# EAGLE design v1-cellphone (EAGLE 6.4)

## Sheet 1 of 3: PWR
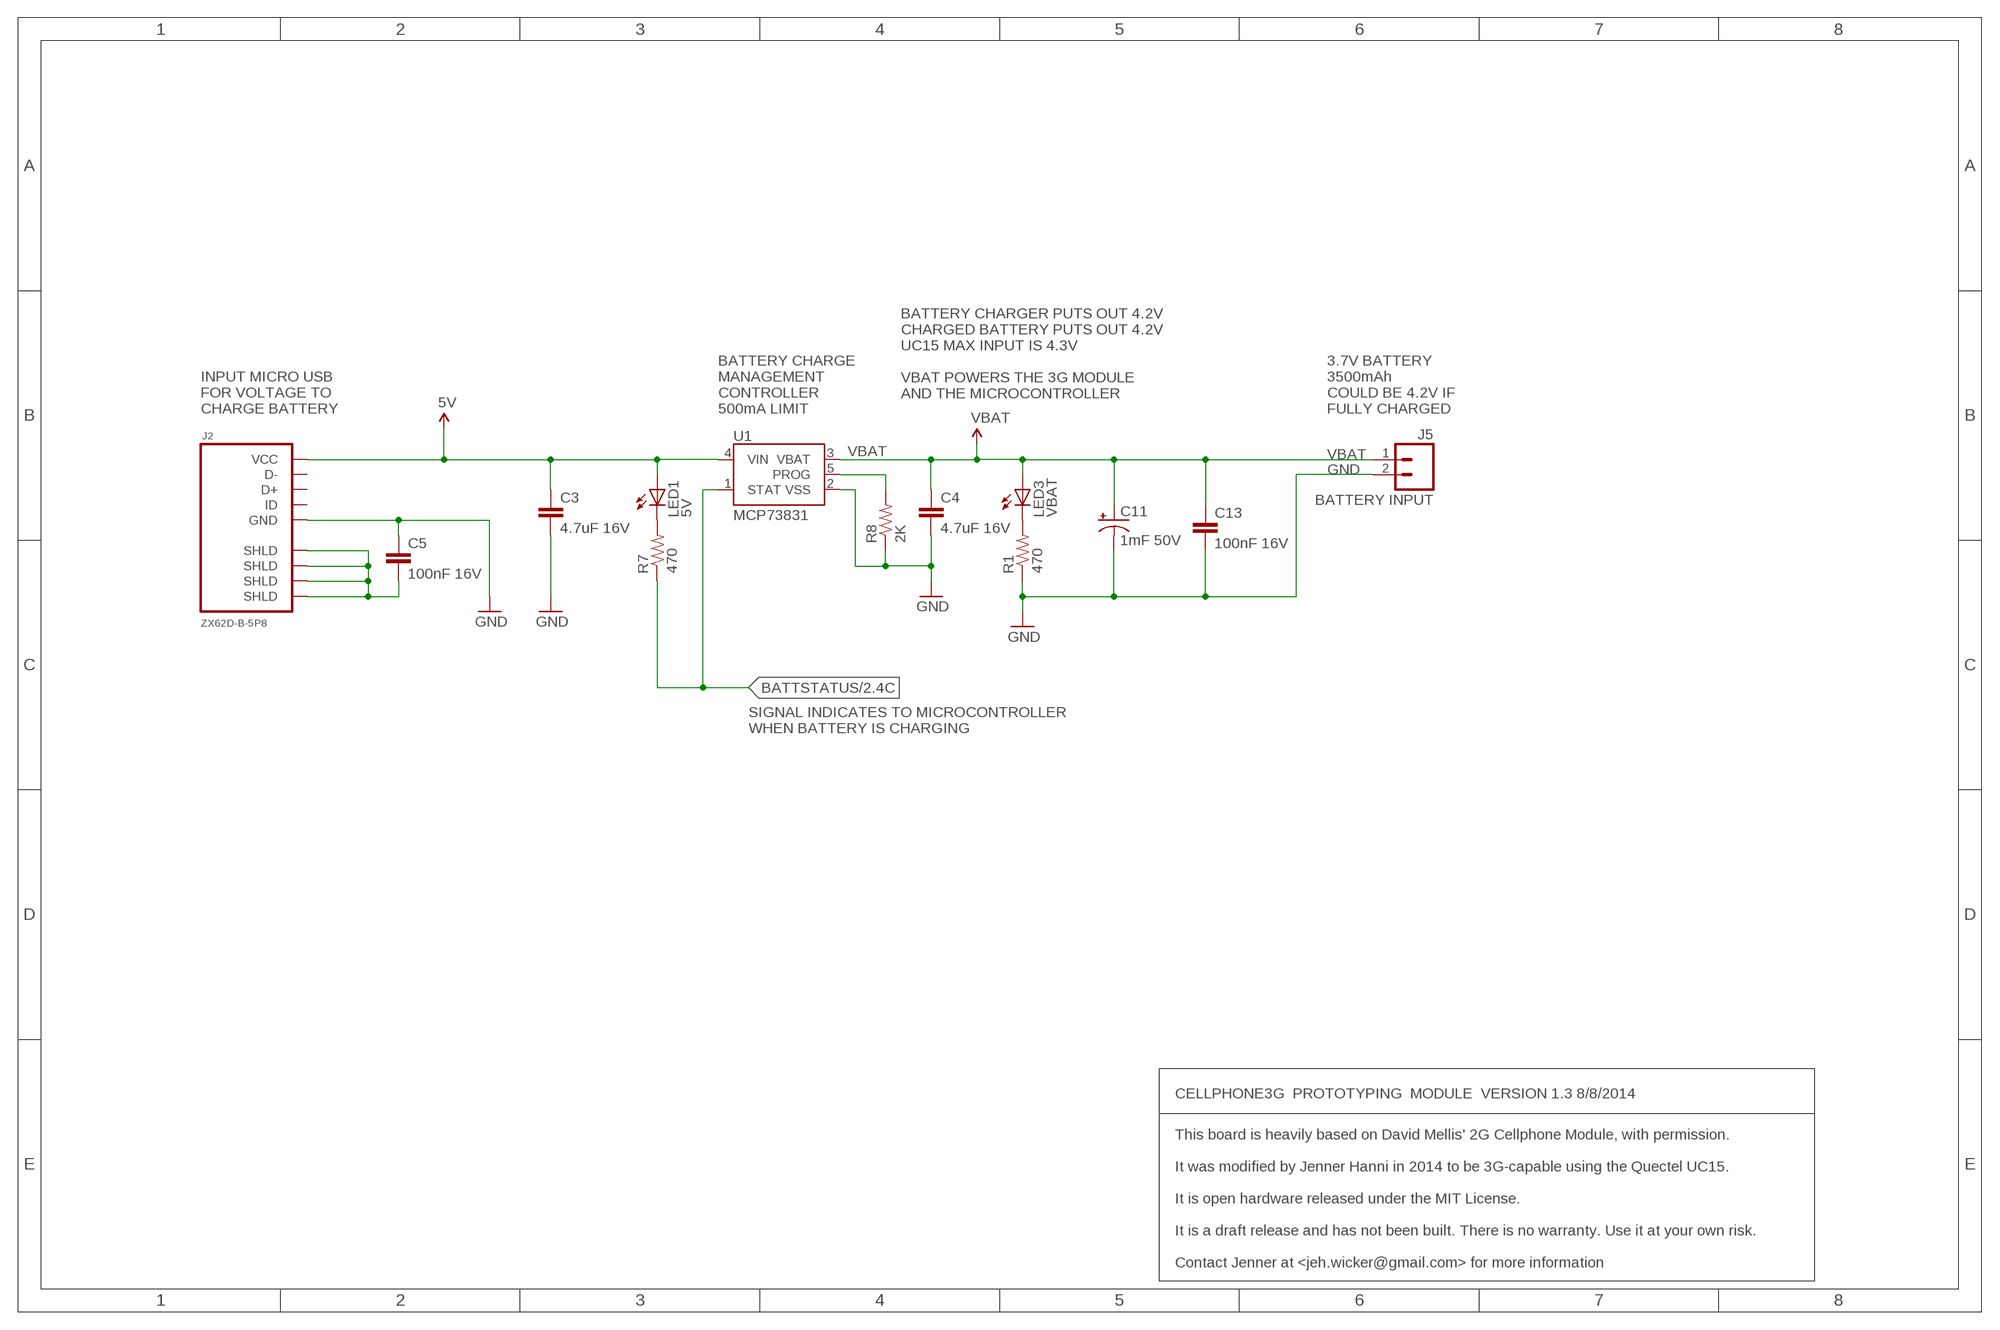
[diagram p0: schematic, sheet 1]

### Parts
C3  4.7uF 16V  C-EU0603-B  [0603-B]
C4  4.7uF 16V  C-EU0603-B  [0603-B]
C5  100nF 16V  C-EU0603-B  [0603-B]
C11  1mF 50V  CAP_POLPTH4  [CPOL-RADIAL-1000UF-25V]
C13  100nF 16V  C-EU0603-B  [0603-B]
J2  ZX62D-B-5P8  [ZX62D-B-5P8]
J5  BATTERY INPUT  M02-JST-2MM-SMT  [JST-2-SMD]
LED1  5V  LEDCHIP-LED0603  [CHIP-LED0603]
LED3  VBAT  LEDCHIP-LED0603  [CHIP-LED0603]
R1  470  R-US_0603-B  [0603-B]
R7  470  R-US_0603-B  [0603-B]
R8  2K  R-US_0603-B  [0603-B]
U1  MCP73831  SPARKFUN_MCP73831  [SPARKFUN_SOT23-5]

### Nets
5V: C3.1 J2.P1(VCC) LED1.A U1.4(VIN) ; also sheet 2
BATTSTATUS: R7.1 U1.1(STAT) ; also sheet 2
GND: C3.2 C4.2 C5.1 C11.2(-) C13.2 J2.P5(GND) J5.2 R1.1 R8.1 U1.2(VSS) ; also sheet 2,3
N$2: LED3.C R1.2
N$4: LED1.C R7.2
PROG: R8.2 U1.5(PROG)
SHLD: C5.2 J2.P$1(SHLD) J2.P$2(SHLD) J2.P$3(SHLD) J2.P$4(SHLD)
VBAT: C4.1 C11.1(+) C13.1 J5.1 LED3.A U1.3(VBAT) ; also sheet 2,3
Unconnected: J2.P2(D-) J2.P3(D+) J2.P4(ID)

### Notes on the sheet
- BATTERY CHARGER PUTS OUT 4.2V
  CHARGED BATTERY PUTS OUT 4.2V
  UC15 MAX INPUT IS 4.3V
  
  VBAT POWERS THE 3G MODULE
  AND THE MICROCONTROLLER
- INPUT MICRO USB 
  FOR VOLTAGE TO
  CHARGE BATTERY
- BATTERY CHARGE
  MANAGEMENT
  CONTROLLER
  500mA LIMIT
- 3.7V BATTERY
  3500mAh
  COULD BE 4.2V IF
  FULLY CHARGED
- SIGNAL INDICATES TO MICROCONTROLLER
  WHEN BATTERY IS CHARGING
- CELLPHONE3G  PROTOTYPING  MODULE  VERSION 1.3 8/8/2014
- This board is heavily based on David Mellis' 2G Cellphone Module, with permission. 
  
  It was modified by Jenner Hanni in 2014 to be 3G-capable using the Quectel UC15. 
  
  It is open hardware released under the MIT License. 
  
  It is a draft release and has not been built. There is no warranty. Use it at your own risk.
  
  Contact Jenner at <jeh.wicker@gmail.com> for more information

## Sheet 2 of 3: CTRL
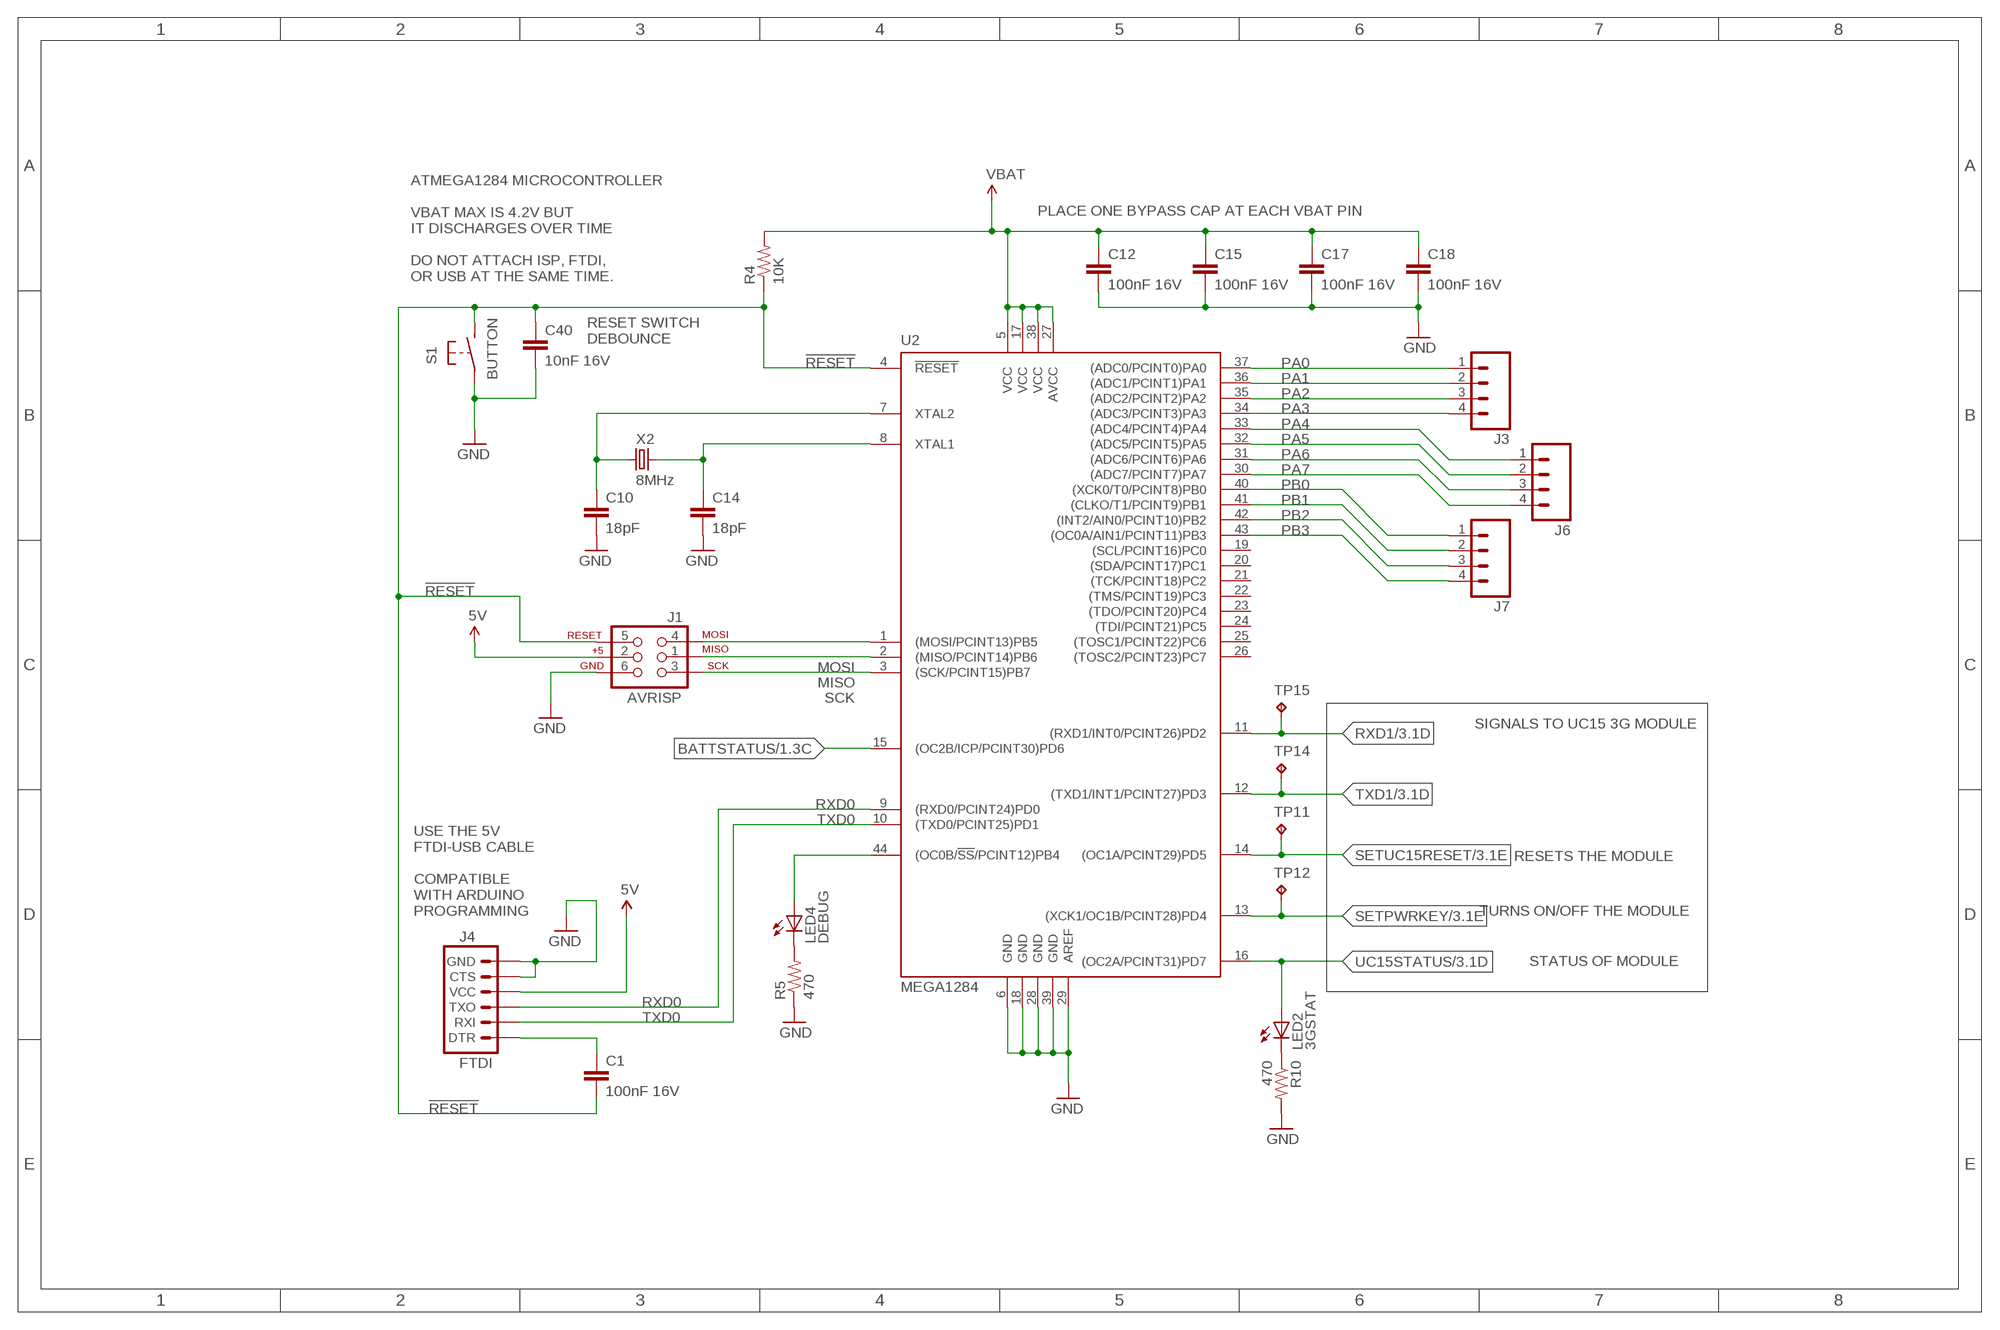
[diagram p1: schematic, sheet 2]

### Parts
C1  100nF 16V  C-EU0603-B  [0603-B]
C10  18pF  C-EU0603-B  [0603-B]
C12  100nF 16V  C-EU0603-B  [0603-B]
C14  18pF  C-EU0603-B  [0603-B]
C15  100nF 16V  C-EU0603-B  [0603-B]
C17  100nF 16V  C-EU0603-B  [0603-B]
C18  100nF 16V  C-EU0603-B  [0603-B]
C40  10nF 16V  C-EU0603-B  [0603-B]
J1  AVRISP  SPARKFUN-CONNECTORS_AVR_SPI_PRG_6NS  [SPARKFUN-CONNECTORS_2X3-NS]
J3  M04LOCK  [1X04_LOCK]
J4  FTDI  ARDUINO_SERIAL_PROGRAMLOCK  [1X06_LOCK]
J6  M04LOCK  [1X04_LOCK]
J7  M04LOCK  [1X04_LOCK]
LED2  3GSTAT  LEDCHIP-LED0603  [CHIP-LED0603]
LED4  DEBUG  LEDCHIP-LED0603  [CHIP-LED0603]
R4  10K  R-US_0603-B  [0603-B]
R5  470  R-US_0603-B  [0603-B]
R10  470  R-US_0603-B  [0603-B]
S1  BUTTON  CELLPHONE_BUTTON-2  [CELLPHONE_B3U-1000P]
TP11  TPPAD1-13  [P1-13]
TP12  TPPAD1-13  [P1-13]
TP14  TPPAD1-13  [P1-13]
TP15  TPPAD1-13  [P1-13]
U2  MEGA1284  AVR-5_MEGA164P/324P/644P-AU  [AVR-5_TQFP44]
X2  8MHz  CRYSTAL  [2-SMD-5X3MM]

### Nets
5V: J1.2(2-5VCC) J4.4(VCC) ; also sheet 1
!RESET: C1.2 C40.1 J1.5(5-RESET) R4.1 S1.P$2(S) U2.4(!RESET)
BATTSTATUS: U2.15((OC2B/ICP/PCINT30)PD6) ; also sheet 1
DEBUGLED: LED4.A U2.44((OC0B/!SS!/PCINT12)PB4)
GND: C10.2 C12.2 C14.2 C15.2 C17.2 C18.2 C40.2 J1.6(6-GND) J4.5(CTS) J4.6(GND) R5.1 R10.2 S1.P$1(P) U2.6(GND) U2.18(GND) U2.28(GND) U2.29(AREF) U2.39(GND) ; also sheet 1,3
MISO: J1.1(1-MISO) U2.2((MISO/PCINT14)PB6)
MOSI: J1.4(4-MOSI) U2.1((MOSI/PCINT13)PB5)
N$3: LED4.C R5.2
N$5: C1.1 J4.1(DTR)
N$37: LED2.C R10.1
PA0: J3.1 U2.37((ADC0/PCINT0)PA0)
PA1: J3.2 U2.36((ADC1/PCINT1)PA1)
PA2: J3.3 U2.35((ADC2/PCINT2)PA2)
PA3: J3.4 U2.34((ADC3/PCINT3)PA3)
PA4: J6.1 U2.33((ADC4/PCINT4)PA4)
PA5: J6.2 U2.32((ADC5/PCINT5)PA5)
PA6: J6.3 U2.31((ADC6/PCINT6)PA6)
PA7: J6.4 U2.30((ADC7/PCINT7)PA7)
PB0: J7.1 U2.40((XCK0/T0/PCINT8)PB0)
PB1: J7.2 U2.41((CLKO/T1/PCINT9)PB1)
PB2: J7.3 U2.42((INT2/AIN0/PCINT10)PB2)
PB3: J7.4 U2.43((OC0A/AIN1/PCINT11)PB3)
RXD0: J4.3(TXO) U2.9((RXD0/PCINT24)PD0)
RXD1: TP15.TP U2.11((RXD1/INT0/PCINT26)PD2) ; also sheet 3
SCK: J1.3(3-SCK) U2.3((SCK/PCINT15)PB7)
SETPWRKEY: TP12.TP U2.13((XCK1/OC1B/PCINT28)PD4) ; also sheet 3
SETUC15RESET: TP11.TP U2.14((OC1A/PCINT29)PD5) ; also sheet 3
TXD0: J4.2(RXI) U2.10((TXD0/PCINT25)PD1)
TXD1: TP14.TP U2.12((TXD1/INT1/PCINT27)PD3) ; also sheet 3
UC15STATUS: LED2.A U2.16((OC2A/PCINT31)PD7) ; also sheet 3
VBAT: C12.1 C15.1 C17.1 C18.1 R4.2 U2.5(VCC) U2.17(VCC) U2.27(AVCC) U2.38(VCC) ; also sheet 1,3
XTAL1: C14.1 U2.8(XTAL1) X2.P$2
XTAL2: C10.1 U2.7(XTAL2) X2.P$1
Unconnected: U2.19((SCL/PCINT16)PC0) U2.20((SDA/PCINT17)PC1) U2.21((TCK/PCINT18)PC2) U2.22((TMS/PCINT19)PC3) U2.23((TDO/PCINT20)PC4) U2.24((TDI/PCINT21)PC5) U2.25((TOSC1/PCINT22)PC6) U2.26((TOSC2/PCINT23)PC7)

### Notes on the sheet
- PLACE ONE BYPASS CAP AT EACH VBAT PIN
- ATMEGA1284 MICROCONTROLLER
  
  VBAT MAX IS 4.2V BUT
  IT DISCHARGES OVER TIME
  
  DO NOT ATTACH ISP, FTDI, 
  OR USB AT THE SAME TIME.
- RESET SWITCH
  DEBOUNCE
- SIGNALS TO UC15 3G MODULE
- RESETS THE MODULE
- USE THE 5V 
  FTDI-USB CABLE
  
  COMPATIBLE
  WITH ARDUINO 
  PROGRAMMING
- TURNS ON/OFF THE MODULE
- STATUS OF MODULE

## Sheet 3 of 3: CELL
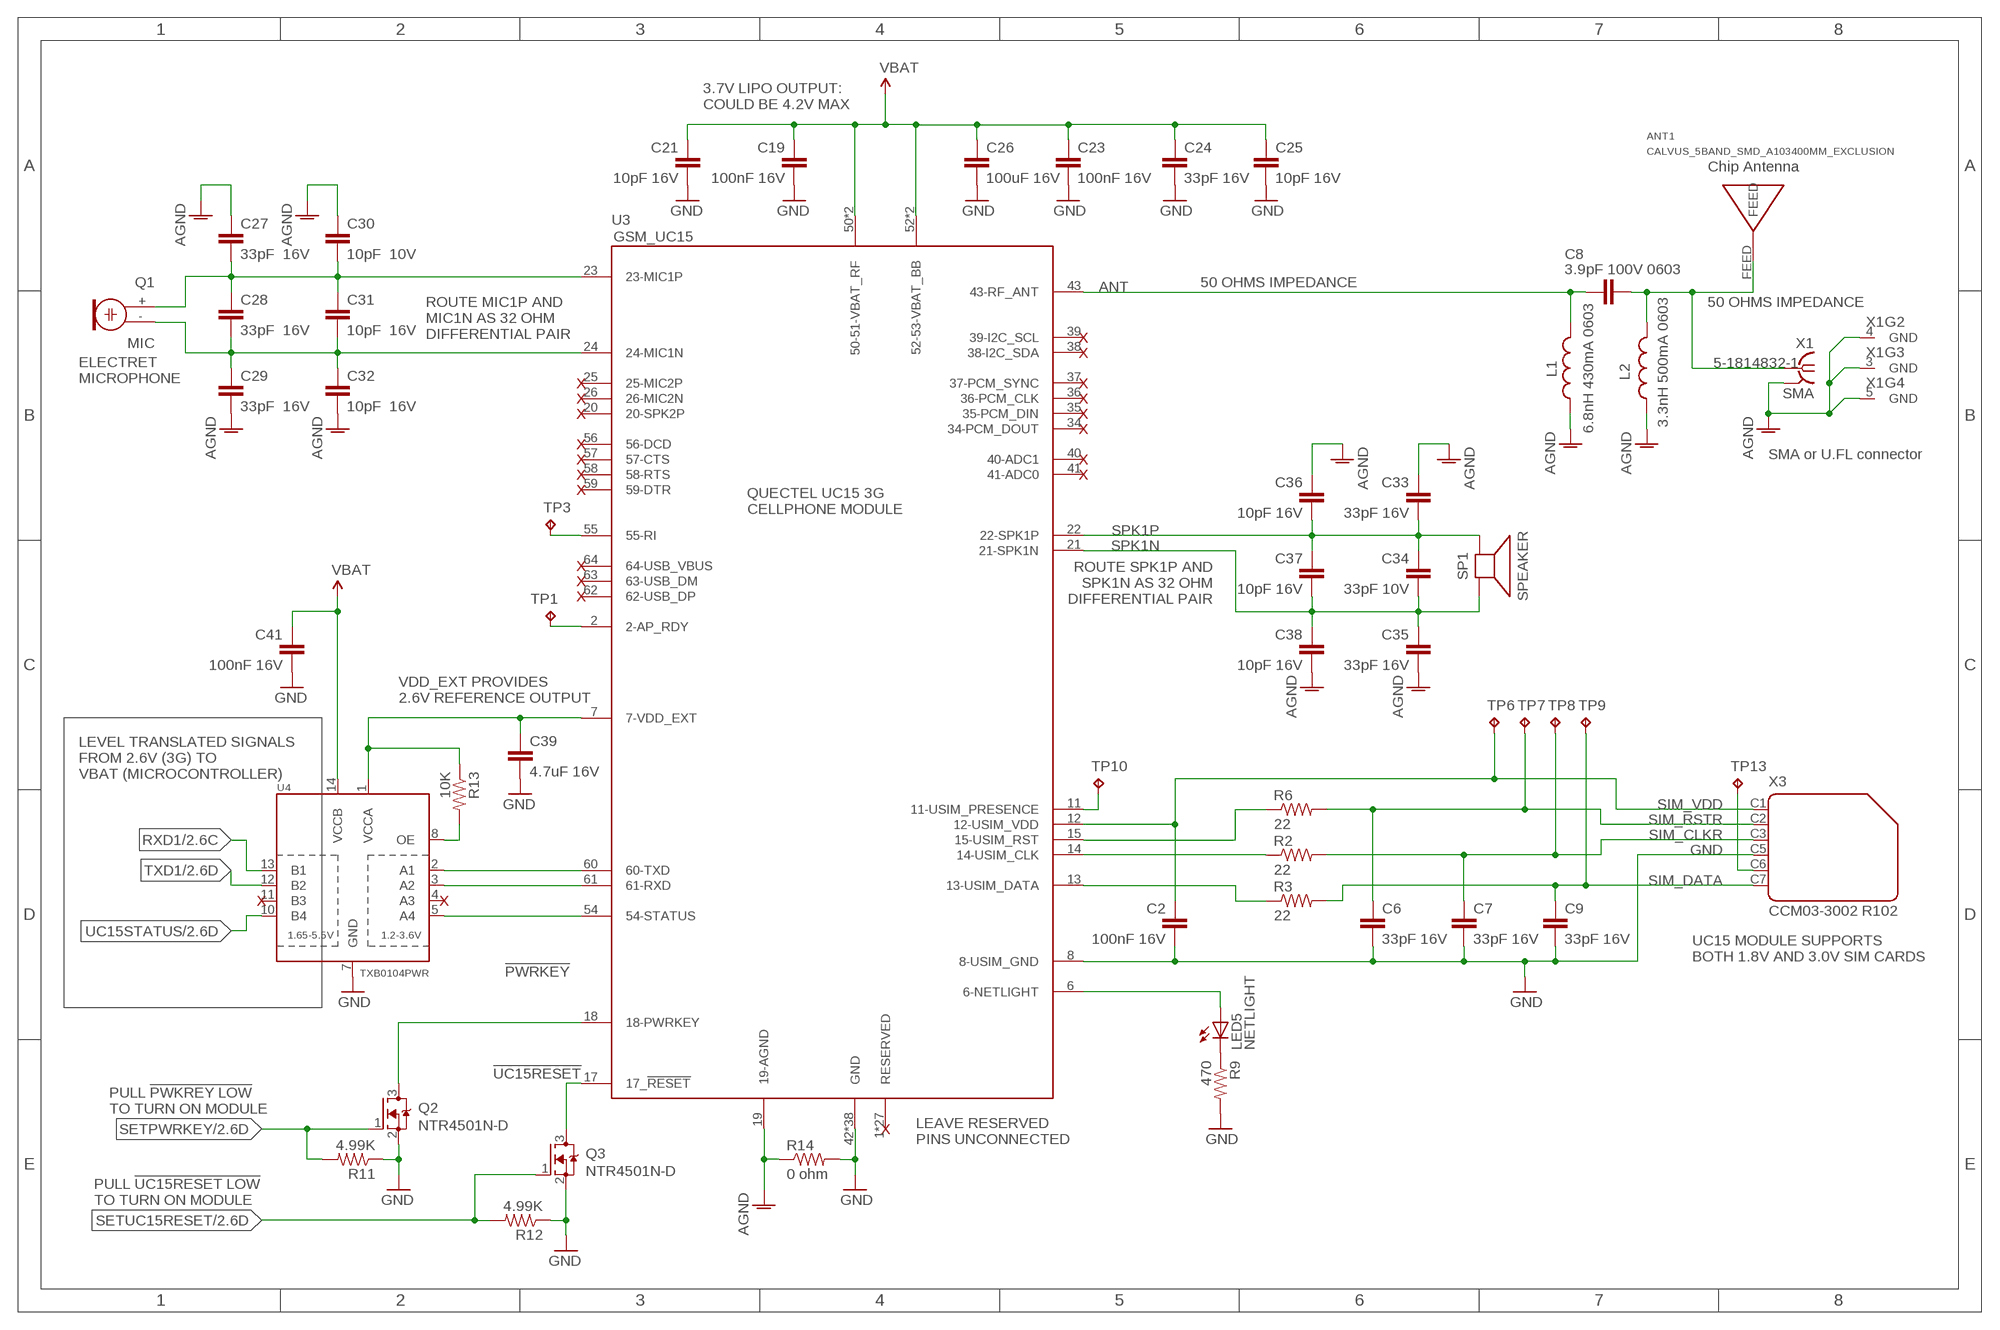
[diagram p2: schematic, sheet 3]

### Parts
ANT1  CALVUS_5BAND_SMD_A103400MM_EXCLUSION  [CALVUS_5BAND_SMD_A10340_0MM_EXCLUSION]
C2  100nF 16V  C-EU0603-B  [0603-B]
C6  33pF 16V  C-EU0603-B  [0603-B]
C7  33pF 16V  C-EU0603-B  [0603-B]
C8  3.9pF 100V 0603  C-EU0603-B  [0603-B]
C9  33pF 16V  C-EU0603-B  [0603-B]
C19  100nF 16V  C-EU0603-B  [0603-B]
C21  10pF 16V  C-EU0603-B  [0603-B]
C23  100nF 16V  C-EU0603-B  [0603-B]
C24  33pF 16V  C-EU0603-B  [0603-B]
C25  10pF 16V  C-EU0603-B  [0603-B]
C26  100uF 16V  C-EUC1210K  [C1210K]
C27  33pF 16V  C-EU0603-B  [0603-B]
C28  33pF 16V  C-EU0603-B  [0603-B]
C29  33pF 16V  C-EU0603-B  [0603-B]
C30  10pF 10V  C-EU0603-B  [0603-B]
C31  10pF 16V  C-EU0603-B  [0603-B]
C32  10pF 16V  C-EU0603-B  [0603-B]
C33  33pF 16V  C-EU0603-B  [0603-B]
C34  33pF 10V  C-EU0603-B  [0603-B]
C35  33pF 16V  C-EU0603-B  [0603-B]
C36  10pF 16V  C-EU0603-B  [0603-B]
C37  10pF 16V  C-EU0603-B  [0603-B]
C38  10pF 16V  C-EU0603-B  [0603-B]
C39  4.7uF 16V  C-EU0603-B  [0603-B]
C41  100nF 16V  C-EU0603-B  [0603-B]
L1  6.8nH 430mA 0603  L-US0603-B  [0603-B]
L2  3.3nH 500mA 0603  L-US0603-B  [0603-B]
LED5  NETLIGHT  LEDCHIP-LED0603  [CHIP-LED0603]
Q1  MIC  ELECTRET  [9.7ELECTRET]
Q2  NTR4501N-D  [SOT-23]
Q3  NTR4501N-D  [SOT-23]
R2  22  R-US_0603-B  [0603-B]
R3  22  R-US_0603-B  [0603-B]
R6  22  R-US_0603-B  [0603-B]
R9  470  R-US_0603-B  [0603-B]
R11  4.99K  R-US_0603-B  [0603-B]
R12  4.99K  R-US_0603-B  [0603-B]
R13  10K  R-US_0603-B  [0603-B]
R14  0 ohm  R-US_0603-B  [0603-B]
SP1  SPEAKER  CELLPHONE_MINI-SIREN  [CELLPHONE_SPEAKER-6.4MM]
TP1  TPPAD1-13  [P1-13]
TP3  TPPAD1-13  [P1-13]
TP6  TPPAD1-13  [P1-13]
TP7  TPPAD1-13  [P1-13]
TP8  TPPAD1-13  [P1-13]
TP9  TPPAD1-13  [P1-13]
TP10  TPPAD1-13  [P1-13]
TP13  TPPAD1-13  [P1-13]
U3  GSM_UC15  [GSM_UC15_WITHOUT_EXCLUSION]
U4  TXB0104PWR  [TSSOP14]
X1  SMA  CON-COAX_BU-SMA-V  [CON-COAX_BU-SMA-V]
X3  CCM03-3002 R102  SMARTPRJ_CON-AMPHENOL_SIMLOCK-C707_10M006_512_2  [SMARTPRJ_CON-AMPHENOL_C707_10M006_512_2]

### Nets
!PWRKEY: Q2.3(D) U3.18(18-PWRKEY)
!UC15RESET: Q3.3(D) U3.17(17_!RESET)
AGND: C27.1 C29.2 C30.1 C32.2 C33.1 C35.2 C36.1 C38.2 L1.1 L2.1 R14.1 U3.19(19-AGND) X1.2(GND) X1.3(GND) X1.4(GND) X1.5(GND)
ANT: C8.1 L1.2 U3.43(43-RF_ANT)
ANTENNA: ANT1.FEED C8.2 L2.2 X1.1
GND: C2.2 C6.2 C7.2 C9.2 C19.2 C21.2 C23.2 C24.2 C25.2 C26.2 C39.2 C41.2 Q2.2(S) Q3.2(S) R9.2 R11.1 R12.1 R14.2 U3.8(8-USIM_GND) U3.42(GND) U3.44(GND) U3.45(GND) U3.46(GND) U3.47(GND) U3.48(GND) U3.49(GND) U3.65(GND) U3.67(GND) U3.68(GND) U3.81(GND) U3.82(GND) U3.83(GND) U3.84(GND) U3.85(GND) U3.86(GND) U3.87(GND) U3.88(GND) U3.89(GND) U3.90(GND) U3.91(GND) U3.92(GND) U3.93(GND) U3.94(GND) U3.95(GND) U3.96(GND) U3.97(GND) U3.98(GND) U3.99(GND) U3.100(GND) U3.101(GND) U3.102(GND) U3.103(GND) U3.104(GND) U3.105(GND) U3.106(GND) U3.107(GND) U3.108(GND) U4.7(GND) X3.C5 ; also sheet 1,2
MIC1N: C28.2 C29.1 C31.2 C32.1 Q1.- U3.24(24-MIC1N)
MIC1P: C27.2 C28.1 C30.2 C31.1 Q1.+ U3.23(23-MIC1P)
N$1: R3.1 U3.13(13-USIM_DATA)
N$6: LED5.C R9.1
N$7: TP13.TP X3.C6
N$13: TP1.TP U3.2(2-AP_RDY)
N$15: TP3.TP U3.55(55-RI)
N$20: U3.60(60-TXD) U4.2(A1)
N$21: U3.61(61-RXD) U4.3(A2)
N$23: U3.54(54-STATUS) U4.5(A4)
NETLIGHT: LED5.A U3.6(6-NETLIGHT)
OE: R13.2 U4.8(OE)
PRESENCE: TP10.TP U3.11(11-USIM_PRESENCE)
RXD1: U4.13(B1) ; also sheet 2
SETPWRKEY: Q2.1(G) R11.2 ; also sheet 2
SETUC15RESET: Q3.1(G) R12.2 ; also sheet 2
SIM_CLK: R2.1 U3.14(14-USIM_CLK)
SIM_CLKR: C7.1 R2.2 TP8.TP X3.C3
SIM_DATA: C9.1 R3.2 TP9.TP X3.C7
SIM_RST: R6.1 U3.15(15-USIM_RST)
SIM_RSTR: C6.1 R6.2 TP7.TP X3.C2
SIM_VDD: C2.1 TP6.TP U3.12(12-USIM_VDD) X3.C1
SPK1N: C34.2 C35.1 C37.2 C38.1 SP1.NEG U3.21(21-SPK1N)
SPK1P: C33.2 C34.1 C36.2 C37.1 SP1.POS U3.22(22-SPK1P)
TXD1: U4.12(B2) ; also sheet 2
UC15STATUS: U4.10(B4) ; also sheet 2
VBAT: C19.1 C21.1 C23.1 C24.1 C25.1 C26.1 C41.1 U3.50(50-51-VBAT_RF) U3.51(50-51-VBAT_RF) U3.52(52-53-VBAT_BB) U3.53(52-53-VBAT_BB) U4.14(VCCB) ; also sheet 1,2
VDD_EXT: C39.1 R13.1 U3.7(7-VDD_EXT) U4.1(VCCA)
Unconnected: U3.1(RESERVED) U3.3(RESERVED) U3.4(RESERVED) U3.5(RESERVED) U3.9(RESERVED) U3.10(RESERVED) U3.16(RESERVED) U3.20(20-SPK2P) U3.25(25-MIC2P) U3.26(26-MIC2N) U3.27(RESERVED) U3.28(RESERVED) U3.29(RESERVED) U3.30(RESERVED) U3.31(RESERVED) U3.32(RESERVED) U3.33(RESERVED) U3.34(34-PCM_DOUT) U3.35(35-PCM_DIN) U3.36(36-PCM_CLK) U3.37(37-PCM_SYNC) U3.38(38-I2C_SDA) U3.39(39-I2C_SCL) U3.40(40-ADC1) U3.41(41-ADC0) U3.56(56-DCD) U3.57(57-CTS) U3.58(58-RTS) U3.59(59-DTR) U3.62(62-USB_DP) U3.63(63-USB_DM) U3.64(64-USB_VBUS) U3.66(RESERVED) U3.69(RESERVED) U3.70(RESERVED) U3.71(RESERVED) U3.72(RESERVED) U3.73(RESERVED) U3.74(RESERVED) U3.75(RESERVED) U3.76(RESERVED) U3.77(RESERVED) U3.78(RESERVED) U3.79(RESERVED) U3.80(RESERVED) U4.4(A3) U4.11(B3)

### Notes on the sheet
- 3.7V LIPO OUTPUT: 
  COULD BE 4.2V MAX
- Chip Antenna
- 50 OHMS IMPEDANCE
- 50 OHMS IMPEDANCE
- X
- ROUTE MIC1P AND 
  MIC1N AS 32 OHM
  DIFFERENTIAL PAIR
- X
- ELECTRET
  MICROPHONE
- X | X
- X | X
- X | X
- X
- X
- X | X | SMA or U.FL connector
- X | X
- X
- QUECTEL UC15 3G
  CELLPHONE MODULE
- X
- X
- X
- ROUTE SPK1P AND
  SPK1N AS 32 OHM
  DIFFERENTIAL PAIR
- VDD_EXT PROVIDES 
  2.6V REFERENCE OUTPUT
- LEVEL TRANSLATED SIGNALS
  FROM 2.6V (3G) TO 
  VBAT (MICROCONTROLLER)
- X | X
- UC15 MODULE SUPPORTS 
  BOTH 1.8V AND 3.0V SIM CARDS
- PULL !PWKREY LOW
  TO TURN ON MODULE
- X
- LEAVE RESERVED
  PINS UNCONNECTED
- PULL !UC15RESET LOW
  TO TURN ON MODULE

## Library data of the parts
ANT1 = SmartPrj:CALVUS_5BAND_SMD_A10340
C1-C10 C12-C15 C17-C19 C21 C23-C41 = rcl_custom:C-EU: CAPACITOR, European symbol
C11 = SparkFun-Capacitors:CAP_POL: Capacitor Polarized These are standard SMD and PTH capacitors. Normally 10uF, 47uF, and 100uF in electrolytic and tantalum varieties. Always verify the external diameter of the through hole cap, it varies with capacity, voltage, and manufacturer. The EIA devices should be standard.
J1 = v1-cellphone:SPARKFUN-CONNECTORS_AVR_SPI_PRG_6: AVR ISP 6 Pin This is the reduced ISP connector for AVR programming. Common on Arduino. This footprint will take up less PCB space and can be used with a 10-pin to 6-pin adapter such as SKU: BOB-08508
J2 = con-hirose-microusb:ZX62D-B-5P8
J3 J6 J7 = SparkFun-Connectors:M04: Header 4 Standard 4-pin 0.1" header. Use with straight break away headers (SKU : PRT-00116), right angle break away headers (PRT-00553), swiss pins (PRT-00743), machine pins (PRT-00117), and female headers (PRT-00115). Molex polarized connector foot print use with SKU : PRT-08231 with associated crimp pins and housings. 1MM SMD Version SKU: PRT-10208
J4 = SparkFun-Connectors:ARDUINO_SERIAL_PROGRAM: FTDI connector footprints
J5 = SparkFun-Connectors:M02: Standard 2-pin 0.1" header. Use with - straight break away headers ( PRT-00116) - right angle break away headers (PRT-00553) - swiss pins (PRT-00743) - machine pins (PRT-00117) - female headers (PRT-00115) Molex polarized connector foot print use with: PRT-08233 with associated crimp pins and housings. 2.54_SCREWTERM for use with PRT-10571. 3.5mm Screw Terminal footprints for PRT-08084 5mm Screw Terminal footprints for use with PRT-08433; PROD_ID: CONN-08352
L1 L2 = rcl_custom:L-US: INDUCTOR, American symbol
LED1-LED5 = adafruit:LED: LED OSRAM: - CHIPLED LG R971, LG N971, LY N971, LG Q971, LY Q971, LO R971, LY R971 LH N974, LH R974 LS Q976, LO Q976, LY Q976 LO Q996 - Hyper CHIPLED LW Q18S LB Q993, LB Q99A, LB R99A - SideLED LS A670, LO A670, LY A670, LG A670, LP A670 LB A673, LV A673, LT A673, LW A673 LH A674 LY A675 LS A676, LA A676, LO A676, LY A676, LW A676 LS A679, LY A679, LG A679 - Hyper Micro SIDELED® LS Y876, LA Y876, LO Y876, LY Y876 LT Y87S - SmartLED LW L88C, LW L88S LB L89C, LB L89S, LG L890 LS L89K, LO L89K, LY L89K LS L896, LA L896, LO L896, LY L896 - TOPLED LS T670, LO T670, LY T670, LG T670, LP T670 LSG T670, LSP T670, LSY T670, LOP T670, LYG T670 LG T671, LOG T671, LSG T671 LB T673, LV T673, LT T673, LW T673 LH T674 LS T676, LA T676, LO T676, LY T676, LB T676, LH T676, LSB T676, LW T676 LB T67C, LV T67C, LT T67C, LS T67K, LO T67K, LY T67K, LW E67C LS E67B, LA E67B, LO E67B, LY E67B, LB E67C, LV E67C, LT E67C LW T67C LS T679, LY T679, LG T679 LS T770, LO T770, LY T770, LG T770, LP T770 LB T773, LV T773, LT T773, LW T773 LH T774 LS E675, LA E675, LY E675, LS T675 LS T776, LA T776, LO T776, LY T776, LB T776 LHGB T686 LT T68C, LB T68C - Hyper Mini TOPLED® LB M676 - Mini TOPLED Santana® LG M470 LS M47K, LO M47K, LY M47K Source: http://www.osram.convergy.de/
Q1 = adafruit:ELECTRET: Electret microphone Thru hole 2.54mm spacing with 9.7mm diameter
Q2 Q3 = max-viz:NTR4501N-D
R1-R14 = rcl_custom:R-US_: RESISTOR, American symbol
S1 = v1-cellphone:CELLPHONE_BUTTON-2
SP1 = v1-cellphone:CELLPHONE_MINI-SIREN
TP1 TP3 TP6-TP15 = testpad:TP: Test pad
U1 = v1-cellphone:SPARKFUN_MCP73831: Microchip's MCP73831 Miniature single cell, fully integrated Li-Ion, Li-polymer charge management controller http://ww1.microchip.com/downloads/en/DeviceDoc/21984a.pdf
U2 = v1-cellphone:AVR-5_MEGA164P/324P/644P-AU
U3 = v1-cellphone:GSM_UC15
U4 = SparkFun-DigitalIC:TXB0104PWR: 4-Bit Bi-Directional Level Shifter 1.2V-3.6V (VCCA) to 1.65V-5.5V (VCCB) bi-directional level shifter with auto direction sensing. Max data rate - VCCA 1.8V: 20Mbps (50ns), VCCA 3.3V: 100Mbps (10ns) Digikey: 296-21929-1-ND (TSSOP) IC-11329
X1 = v1-cellphone:CON-COAX_BU-SMA-V: FEMALE SMA CONNECTOR Radiall distributor RS 112-3794; PN: 5-1814832-1
X2 = fab:CRYSTAL
X3 = v1-cellphone:SMARTPRJ_CON-AMPHENOL_SIMLOCK-C707_10M006_512_2: C707A SIMLOCK® 2.5 mm with wide solder tails Source: Data sheet <http://www.amphenol.info/downloads/C707_10M006_512_2.pdf>; OC_FARNELL: 1463072; OC_NEWARK: unknown

## Net classes
1 power: width 0.254 mm, drill 0.406 mm, clearance 0.178 mm
2 gnd: width 0.254 mm, drill 0.406 mm, clearance 0.178 mm
3 power usb: width 0.254 mm, drill 0.406 mm, clearance 0.178 mm
4 antenna: clearance 0.61 mm

## Board
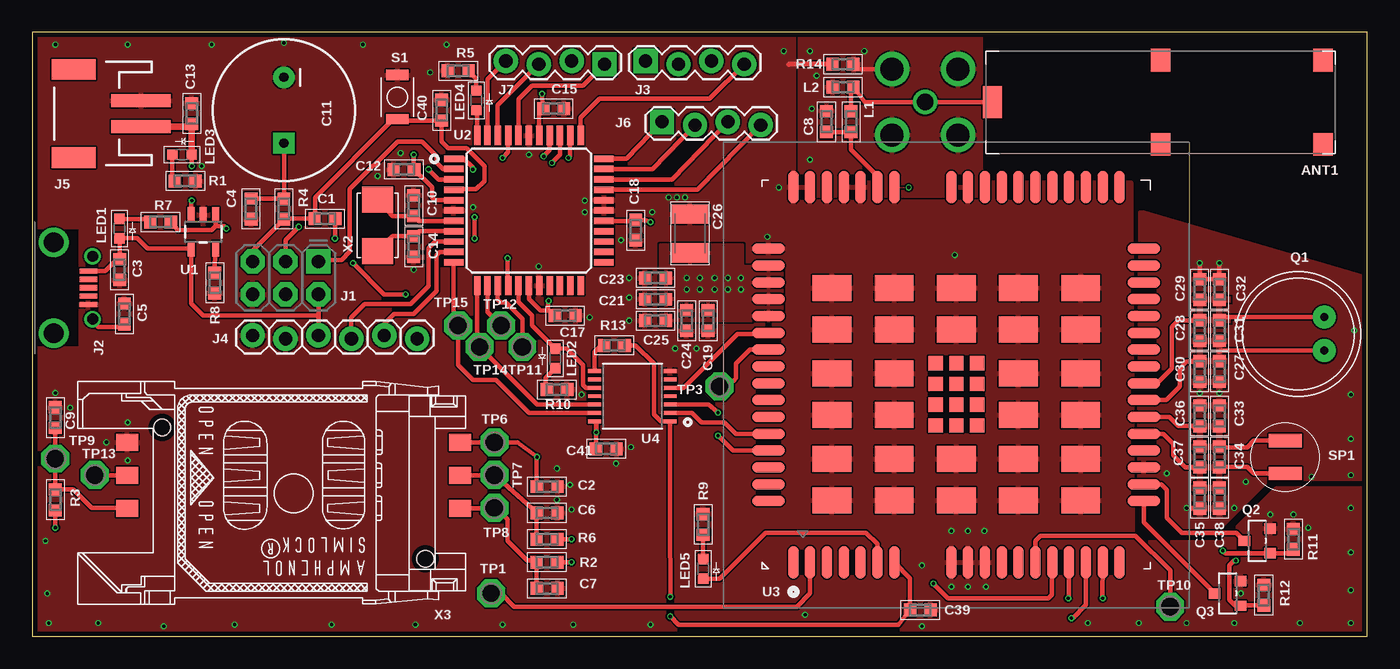
[diagram p3: board, top side]
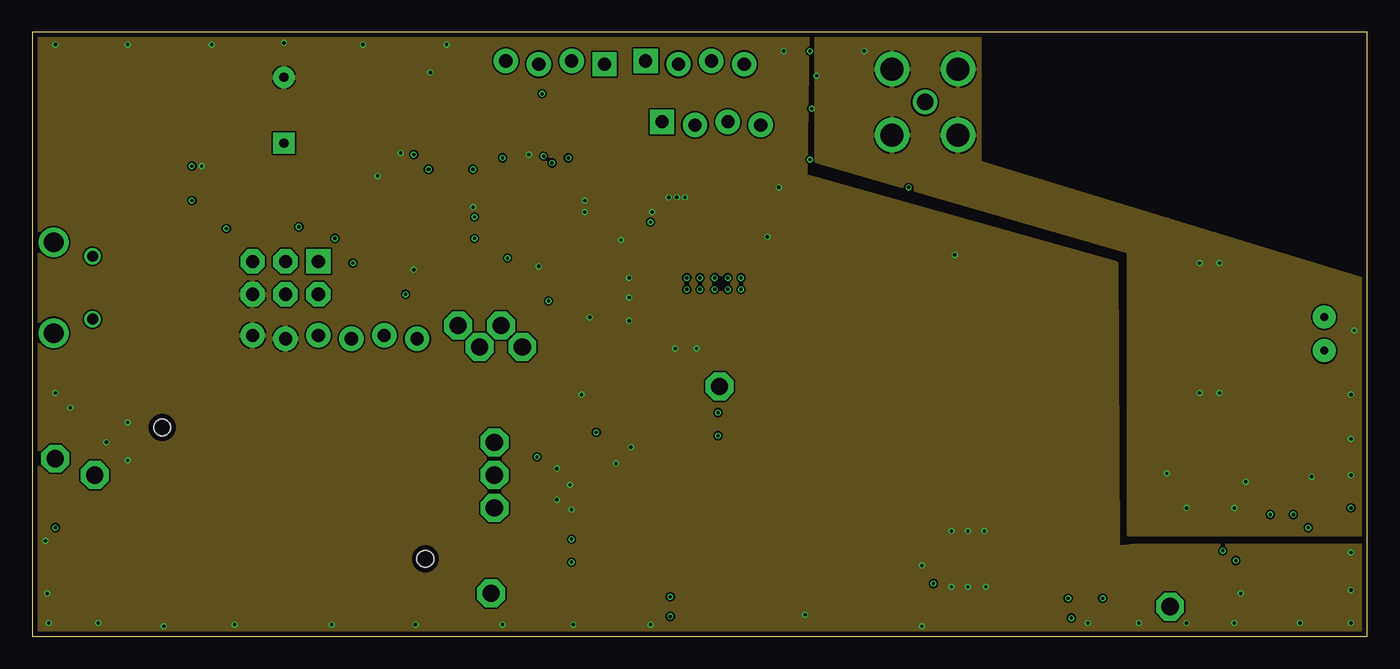
[diagram p4: board, inner layer GND]
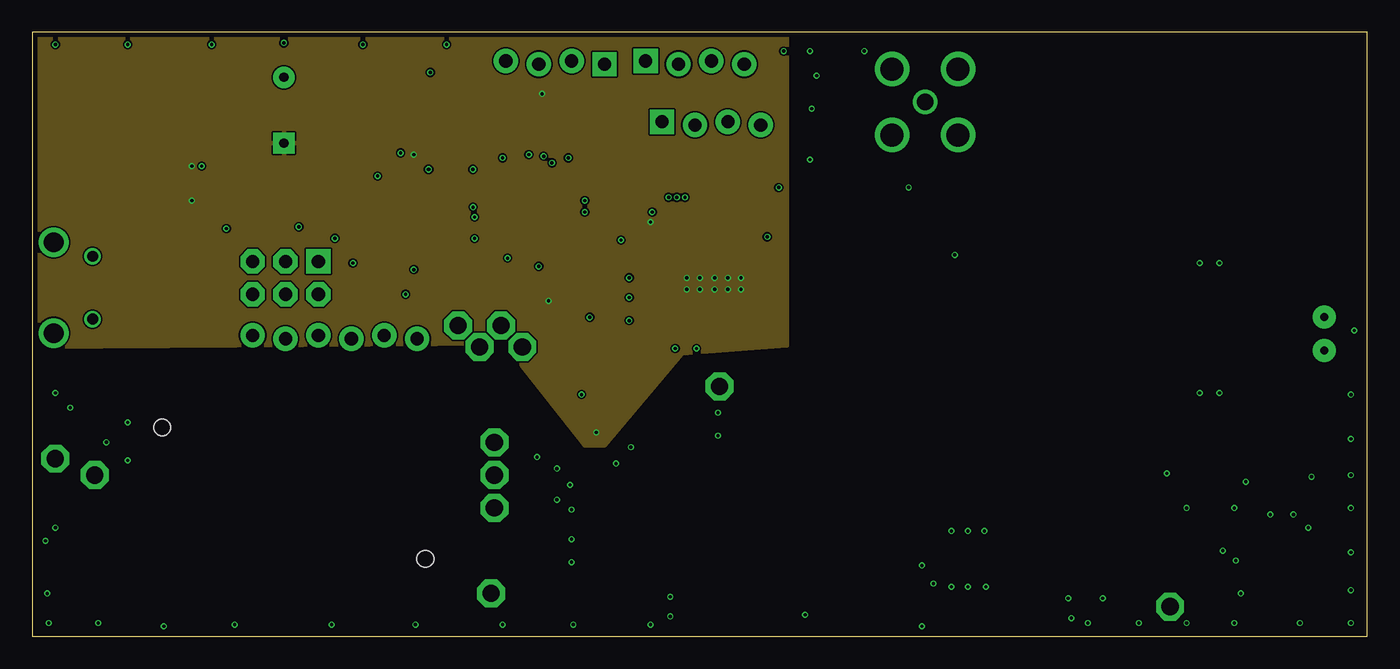
[diagram p5: board, inner layer PWR]
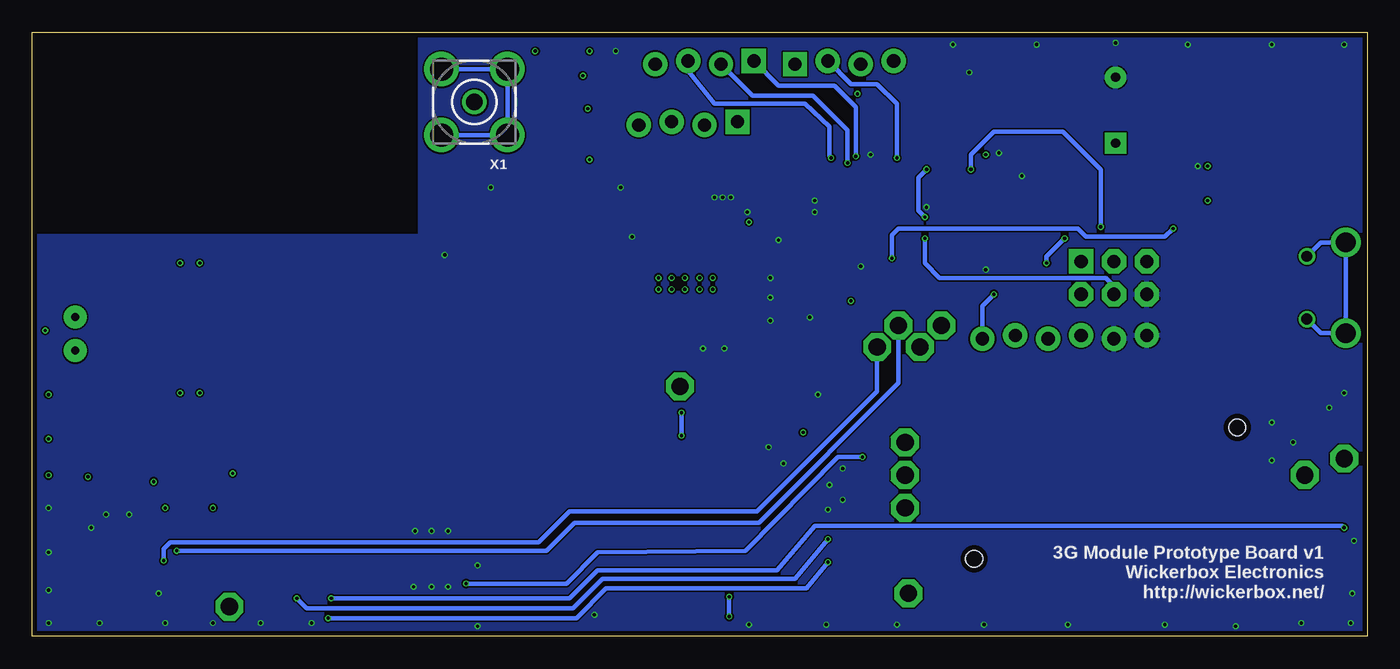
[diagram p6: board, bottom side, seen from below]

Size 103.1 x 46.66 mm. Coordinates in mm from the lower left corner, seen from the top.
Outline: 0,0 103.1,0 103.1,46.66 0,46.66 0,0
Copper layers (1+2*15+16): Top 0.035559375mm / dielectric 0.17018125mm / GND 0.01778125mm / dielectric 47mil / PWR 0.01778125mm / dielectric 0.17018125mm / Bottom 0.035559375mm
Design rules "osh-park-4layer": minimum track width 5mil, minimum drill 10mil, track to track 5mil, track to pad 5mil, pad to pad 5mil, via to via 5mil, smd to smd 5mil, copper to edge 15mil, drill to drill 5mil, minimum pad ring 7mil, minimum via ring 4mil, stop-mask expansion 3mil, vias tented up to drill 0mil, thermal gap 5mil

### Footprints (pad centres in the part's own frame; a part is rotated, then mirrored left to right if it is on the bottom)
CALVUS_5BAND_SMD_A10340_0MM_EXCLUSION = smd 2.5 x 1.5: FEED 3.95,0.5 | smd 1.75 x 1.5: FIXINGPOINT$1 0.7,26.05; FIXINGPOINT$2 7.22,26.05; FIXINGPOINT$3 0.7,13.49; FIXINGPOINT$4 7.22,13.49
0603-B = smd 0.95 x 1: 1 -0.8,0; 2 0.8,0
CPOL-RADIAL-1000UF-25V = drill 0.7 pad 1.651 square: 1 2.54,0 | drill 0.7 pad 1.651: 2 -2.54,0
C1210K = smd 1.5 x 2.9: 1 -1.5,0; 2 1.5,0
SPARKFUN-CONNECTORS_2X3-NS = drill 1.016 pad 1.88 square: 1 -2.54,-1.27 | drill 1.016 pad 1.88 octagon: 2 -2.54,1.27; 3 0,-1.27; 4 0,1.27; 5 2.54,-1.27; 6 2.54,1.27
ZX62D-B-5P8 = smd 0.4 x 1.35: P1 -1.3,2.675; P2 -0.65,2.675; P3 0,2.675; P4 0.65,2.675; P5 1.3,2.675 | drill 1.524: P$1 3.51,0; P$2 -3.51,0 | drill 0.838: P$3 -2.425,3; P$4 2.425,3
1X04_LOCK = drill 1.016 pad 1.88 square: 1 0,0.127 | drill 1.016 pad 1.88: 2 2.54,-0.127; 3 5.08,0.127; 4 7.62,-0.127
1X06_LOCK = drill 1.016 pad 1.88: 1 0,0; 2 2.54,-0.254; 3 5.08,0; 4 7.62,-0.254; 5 10.16,0; 6 12.7,-0.254
JST-2-SMD = smd 1 x 4.6: 1 -1,-3.7; 2 1,-3.7 | smd 1.6 x 3.4: NC1 -3.4,1.5; NC2 3.4,1.5
CHIP-LED0603 = smd 0.8 x 0.8: A 0,-0.75; C 0,0.75
9.7ELECTRET = drill 0.6 pad 1.778: + 1.3,2; - -1.3,2
SOT-23 = smd 0.8 x 0.9: 1 -0.95,-1; 2 0.95,-1; 3 0,1
CELLPHONE_B3U-1000P = smd 0.8 x 1.7: P$1 -1.7,0; P$2 1.7,0
CELLPHONE_SPEAKER-6.4MM = smd 1.016 x 2.54: NEG 1.27,0; POS -1.27,0
P1-13 = drill 1.321 pad 2.159 octagon: TP 0,0
SPARKFUN_SOT23-5 = smd 0.55 x 1.2: 1 -0.95,-1.3; 2 0,-1.3; 3 0.95,-1.3; 4 0.95,1.3; 5 -0.95,1.3
AVR-5_TQFP44 = smd 1.5 x 0.5: 1 -5.8,4; 2 -5.8,3.2; 3 -5.8,2.4; 4 -5.8,1.6; 5 -5.8,0.8; 6 -5.8,0; 7 -5.8,-0.8; 8 -5.8,-1.6; 9 -5.8,-2.4; 10 -5.8,-3.2; 11 -5.8,-4; 23 5.8,-4; 24 5.8,-3.2; 25 5.8,-2.4; 26 5.8,-1.6; 27 5.8,-0.8; 28 5.8,0; 29 5.8,0.8; 30 5.8,1.6; 31 5.8,2.4; 32 5.8,3.2; 33 5.8,4 | smd 0.5 x 1.5: 12 -4,-5.8; 13 -3.2,-5.8; 14 -2.4,-5.8; 15 -1.6,-5.8; 16 -0.8,-5.8; 17 0,-5.8; 18 0.8,-5.8; 19 1.6,-5.8; 20 2.4,-5.8; 21 3.2,-5.8; 22 4,-5.8; 34 4,5.8; 35 3.2,5.8; 36 2.4,5.8; 37 1.6,5.8; 38 0.8,5.8; 39 0,5.8; 40 -0.8,5.8; 41 -1.6,5.8; 42 -2.4,5.8; 43 -3.2,5.8; 44 -4,5.8
GSM_UC15_WITHOUT_EXCLUSION = smd 2.5 x 0.8: 1 -14.5,12.6; 2 -14.5,11.3; 3 -14.5,10; 4 -14.5,8.7; 5 -14.5,7.4; 6 -14.5,6.1; 7 -14.5,4.8; 8 -14.5,-2.2; 9 -14.5,-3.5; 10 -14.5,-4.8; 11 -14.5,-6.1; 12 -14.5,-7.4; 13 -14.5,-8.7; 14 -14.5,-10; 15 -14.5,-11.3; 16 -14.5,-12.6; 33 14.5,-12.6; 34 14.5,-11.3; 35 14.5,-10; 36 14.5,-8.7; 37 14.5,-7.4; 38 14.5,-6.1; 39 14.5,-4.8; 40 14.5,-3.5; 41 14.5,-2.2; 42 14.5,4.8; 43 14.5,6.1; 44 14.5,7.4; 45 14.5,8.7; 46 14.5,10; 47 14.5,11.3; 48 14.5,12.6; 65 14.5,-0.9; 66 14.5,0.4; 67 -14.5,0.4; 68 -14.5,-0.9 | smd 0.8 x 2.5: 17 -9.75,-14.5; 18 -8.45,-14.5; 19 -7.15,-14.5; 20 -5.85,-14.5; 21 -4.55,-14.5; 22 -3.25,-14.5; 23 -1.95,-14.5; 24 -0.65,-14.5; 25 0.65,-14.5; 26 1.95,-14.5; 27 3.25,-14.5; 28 4.55,-14.5; 29 5.85,-14.5; 30 7.15,-14.5; 31 8.45,-14.5; 32 9.75,-14.5; 49 9.75,14.5; 50 8.45,14.5; 51 7.15,14.5; 52 5.85,14.5; 53 4.55,14.5; 54 3.25,14.5; 55 1.95,14.5; 56 0.65,14.5; 57 -0.65,14.5; 58 -1.95,14.5; 59 -3.25,14.5; 60 -4.55,14.5; 61 -5.85,14.5; 62 -7.15,14.5; 63 -8.45,14.5; 64 -9.75,14.5 | smd 1.1 x 1.1: 69 0.9,1.6; 70 0.9,0; 71 0.9,-1.6; 72 -0.7,1.6; 73 -0.7,0; 74 -0.7,-1.6; 75 -2.3,1.6; 76 -2.3,0; 77 -2.3,-1.6; 78 -3.9,1.6; 79 -3.9,0; 80 -3.9,-1.6 | smd 2 x 3: 81 6.7,9.6; 82 6.7,4.8; 83 6.7,0; 84 6.7,-4.8; 85 6.7,-9.6; 86 3.5,9.6; 87 3.5,4.8; 88 3.5,0; 89 3.5,-4.8; 90 3.5,-9.6; 91 0.1,9.6; 92 0.1,4.8; 93 0.1,-4.8; 94 0.1,-9.6; 95 -3.1,9.6; 96 -3.1,4.8; 97 -3.1,-4.8; 98 -3.1,-9.6; 99 -6.5,9.6; 100 -6.5,4.8; 101 -6.5,0; 102 -6.5,-4.8; 103 -6.5,-9.6; 104 -9.7,9.6; 105 -9.7,4.8; 106 -9.7,0; 107 -9.7,-4.8; 108 -9.7,-9.6
TSSOP14 = smd 0.305 x 0.991: 1 -1.95,-2.918; 2 -1.3,-2.918; 3 -0.65,-2.918; 4 0,-2.918; 5 0.65,-2.918; 6 1.3,-2.918; 7 1.95,-2.918; 8 1.95,2.918; 9 1.3,2.918; 10 0.65,2.918; 11 0,2.918; 12 -0.65,2.918; 13 -1.3,2.918; 14 -1.95,2.918
CON-COAX_BU-SMA-V = drill 1.27: 1 0,0 | drill 1.778: 2 -2.55,2.55; 3 2.55,2.55; 4 2.55,-2.55; 5 -2.55,-2.55
2-SMD-5X3MM = smd 2 x 2.4: P$1 -2,0; P$2 2,0
SMARTPRJ_CON-AMPHENOL_C707_10M006_512_2 = smd 1.7 x 1.3: C1 -12.85,-3.915; C2 -12.85,-1.375; C3 -12.85,1.165; C5 12.85,-3.915; C6 12.85,-1.375; C7 12.85,1.165 | hole 1.3: 10.16,-5.08; -10.16,5.08

### Placement (x,y rotation side)
ANT1  73.66,45.21 270 top
C1  22.61,32.26 180 top
C2  39.75,11.56 0 top
C3  6.73,28.32 270 top
C4  16.89,33.02 270 top
C5  7.11,24.89 270 top
C6  39.75,9.53 0 top
C7  39.75,3.68 0 top
C8  63.25,39.75 90 top
C9  1.78,16.89 90 top
C10  29.46,33.27 90 top
C11  19.43,40.64 270 top
C12  28.7,36.07 180 top
C13  12.32,40.39 90 top
C14  29.46,30.1 270 top
C15  40.26,40.77 0 top
C17  41.15,24.77 0 top
C18  46.61,31.37 270 top
C19  52.2,24.38 270 top
C21  48.13,26.04 180 top
C23  48.13,27.69 180 top
C24  50.55,24.38 270 top
C25  48.13,24.38 180 top
C26  50.8,31.11 90 top
C27  91.69,20.45 90 top
C28  90.17,23.62 90 top
C29  90.17,26.8 90 top
C30  90.17,20.45 90 top
C31  91.69,23.62 90 top
C32  91.69,26.8 90 top
C33  91.69,17.02 270 top
C34  91.69,13.84 270 top
C35  90.17,10.67 270 top
C36  90.17,17.02 270 top
C37  90.17,13.84 270 top
C38  91.69,10.67 270 top
C39  68.58,2.03 0 top
C40  31.62,40.64 90 top
C41  44.32,14.48 0 top
J1  19.56,27.69 180 top
J2  1.65,26.92 270 top
J3  47.37,44.32 0 top
J4  29.72,22.99 180 top
J5  4.7,40.39 90 top
J6  48.64,39.62 0 top
J7  44.2,44.32 180 top
L1  61.34,39.75 270 top
L2  62.61,42.42 0 top
LED1  6.73,31.5 0 top
LED2  40.39,21.46 180 top
LED3  11.56,37.21 90 top
LED4  34.29,41.4 0 top
LED5  51.82,5.21 0 top
Q1  97.79,23.37 270 top
Q2  94.61,7.37 90 top
Q3  92.33,3.3 90 top
R1  11.81,35.18 180 top
R2  39.75,5.71 180 top
R3  1.78,10.54 90 top
R4  19.43,33.02 90 top
R5  32.89,43.69 0 top
R6  39.75,7.49 180 top
R7  9.91,32 180 top
R8  14.1,27.3 90 top
R9  51.82,8.64 90 top
R10  40.51,19.05 0 top
R11  97.41,7.49 270 top
R12  95.12,3.17 270 top
R13  44.96,22.48 180 top
R14  62.61,44.2 180 top
S1  28.19,41.66 270 top
SP1  96.77,13.84 270 top
TP1  35.43,3.3 0 top
TP3  53.09,19.3 0 top
TP6  35.69,14.99 0 top
TP7  35.69,12.45 0 top
TP8  35.69,9.91 0 top
TP9  1.78,13.72 0 top
TP10  87.88,2.29 0 top
TP11  37.85,22.35 0 top
TP12  36.2,24 0 top
TP13  4.83,12.45 0 top
TP14  34.54,22.35 0 top
TP15  32.89,24 0 top
U1  13.21,31.24 180 top
U2  38.35,32.89 0 top
U3  71.37,20.19 90 top
U4  46.35,18.54 90 top
X1  68.96,41.27 180 bottom
X2  26.67,31.75 270 top
X3  20.19,11.05 180 top

### Tracks (layer width: path | path; a pad name or v marks a point on that pad's centre or on a via)
5V
  Top 0.33: J2.P1 5.62,28.22 6.51,29.12 C3.1 LED1.A 8.12,30.75 8.26,30.61 8.64,30.23 8.92,29.94 U1.4 12.26,25.71 13.21,24.77 21.97,24.77 22.1,24.64 | J4.4 22.1,24.64 | 22.1,24.64 J1.2
!PWRKEY
  Top 0.33: Q2.3 92.98,8 88.77,8 87.63,9.14 87.63,11.3 87.19,11.74 U3.18
!RESET
  Top 0.33: J1.5 17.02,29.81 R4.1 19.47,32.26 C1.2 21.84,32.3 21.84,33.91 27.76,39.83 S1.P$2 29.09,39.84 C40.1 31.62,38.23 32.13,37.72 33.53,37.72 34.92,36.32 34.92,35.18 34.29,34.54 32.6,34.54 U2.4
!UC15RESET
  Top 0.33: Q3.3 85.85,8.78 85.85,10.42 U3.17
AGND  (via drill 0.25 pad 0.46)
  Top 0.33: X1.5 63.42,43.83 R14.1 | v90.17,28.83 C29.2 C32.2 v91.69,28.83 | C35.2 89.19,9.87 v89.15,9.91
  Bottom 0.33: X1.4 X1.5 X1.2 X1.3
  other vias: 91.69,18.8 90.17,18.8 87.63,12.57 92.84,9.91 60.07,45.21 60.07,36.83 60.58,43.31 60.2,40.77 64.26,45.21 102.11,23.62 101.85,18.67 101.85,15.24 101.85,12.45 98.81,12.32 93.73,11.94
  pour Top: 92.2,19.94 89.79,19.94 89.79,17.53 92.2,17.53
  pour Top: 92.08,10.29 89.79,10.29 89.79,9.4 92.08,9.4
  pour GND: 60.58,46.86 60.58,36.7 84.71,29.72 84.71,7.87 103.38,7.87 103.38,27.43 102.36,27.69 73.15,36.58 73.15,46.99 60.45,46.99
  pour Top (rank 5): 85.47,8.13 91.44,8.13 95.5,12.19 103.25,12.19 103.38,26.92 103.38,27.56 85.6,32.77
  pour Top: 59.31,46.23 59.31,34.04 73.28,34.04 73.28,46.23
ANT
  Top 0.33: L1.2 C8.1 63.25,37.59 65.27,35.56 U3.43
ANTENNA
  Top 0.33: ANT1.FEED 74.15,41.27 X1.1 64.3,41.27 L2.2 63.25,42 C8.2
BATTSTATUS  (via drill 0.25 pad 0.46)
  Top 0.33: v36.7,29.21 36.7,27.14 U2.15 | U1.1 14.16,31.68 | 14.16,31.68 13.84,31.37 11.21,31.37 R7.1 | 14.16,31.68 14.8,31.68 v14.99,31.5
  Bottom 0.33: v14.99,31.5 15.62,30.86 21.72,30.86 22.35,31.5 36.2,31.5 36.7,30.99 v36.7,29.21
DEBUGLED
  Top 0.33: U2.44 34.35,40.59 LED4.A
GND  (via drill 0.25 pad 0.46)
  Top 0.381: R14.2 58.42,44.2
  other vias: 26.67,35.56 28.45,37.34 34.04,33.15 38.35,37.21 42.67,32.77 42.67,33.66 39.12,28.57 45.47,30.61 47.88,32.77 49.15,33.91 49.78,33.91 50.42,33.91 56.77,30.86 30.73,43.56 13.08,36.32 59.69,1.65 29.46,28.32 1.78,45.72 7.37,45.72 13.84,45.72 19.43,45.85 25.53,45.72 32,45.72 58.04,45.21 95.63,9.4 97.41,9.4 98.55,8.38 93.34,3.3 43.05,24.64 101.85,9.91 101.85,6.48 101.85,3.56 101.85,1.02 97.92,1.02 92.84,1.02 89.15,1.02 85.47,1.02 81.53,1.02 47.75,0.89 41.78,0.89 36.32,0.89 29.59,0.89 23.11,0.89 15.62,0.89 10.16,0.76 5.08,1.02 1.27,1.02 1.14,3.3 1.02,7.37 5.71,14.99 7.37,16.51 7.37,13.59 1.78,18.8 2.92,17.65 46.23,14.61 45.09,13.34 40.51,12.95 41.53,11.68 41.66,9.78 40.51,10.54 68.71,0.76 68.71,5.46 70.99,8.13 72.26,8.13 73.53,8.13 73.66,3.81 72.26,3.81 70.99,3.81 49.66,22.23 51.31,22.23 46.1,27.69 46.1,26.16 46.1,24.38 67.69,34.67 42.42,18.67 71.25,29.46 57.66,34.67
  pour GND (rank 5): -0.25,-0.38 -0.25,47.24 59.82,46.74 59.69,35.56 60.58,35.31 83.69,28.83 83.82,6.86 85.22,6.99 103.63,6.99 103.63,-0.89 59.82,-0.89
  pour Bottom (rank 5): -0.25,-0.38 -0.25,47.24 72.64,46.99 73.15,46.99 73.15,30.86 103.63,30.86 103.38,-0.38
  pour Top (rank 5): -0.51,-0.38 -0.51,47.24 58.8,47.24 58.8,35.05 84.84,35.05 84.96,7.24 91.95,7.24 96.14,11.43 103.25,11.43 103.12,-0.38
MIC1N
  Top 0.33: Q1.- 91.94,24.67 C31.2 | U3.24 86.85,19.54 88.01,20.7 88.01,23.88 88.52,24.38 90.13,24.38 C28.2
  pour Top: 92.33,26.29 89.79,26.29 89.79,24.13 92.33,24.13
MIC1P
  Top 0.33: Q1.+ 91.79,22.07 91.69,21.97 | U3.23 87.58,18.24 88.65,19.3 88.65,20.7 89.15,21.21 90.13,21.21 C30.2
  pour Top: 92.08,23.11 89.79,23.11 89.79,20.95 92.08,20.95
MISO
  Top 0.33: U2.2 31.73,36.09 31.24,36.58 31.24,37.08 30.1,38.23 28.19,38.23 24.51,34.54 24.51,29.72 23.88,29.08 22.23,29.08 J1.1
MOSI  (via drill 0.25 pad 0.46, 0.28 pad 0.46)
  Top 0.33: v34.04,36.07 34.04,36.2 33.27,36.96 32.62,36.96 U2.1 | v34.16,32.38 v34.16,30.73
  Bottom 0.33: J1.4 19.56,27.05 20.19,27.69 33.02,27.69 34.16,28.83 v34.16,30.73 | v34.16,32.38 34.67,32.89 34.67,35.43 v34.04,36.07
N$1  (via drill 0.25 pad 0.46)
  Top 0.33: U3.13 80.05,2.96 v80.01,2.92 | v1.78,8.38 R3.1
  Bottom 0.33: v80.01,2.92 61.59,2.92 59.44,5.08 45.59,5.08 42.67,8.51 1.91,8.51 v1.78,8.38
N$2
  Top 0.33: LED3.C 10.81,35.38 R1.2
N$3
  Top 0.33: LED4.C 34.29,43.09 R5.2
N$4
  Top 0.33: LED1.C 8.74,32.25 R7.2
N$5  (via drill 0.25 pad 0.46, 0.28 pad 0.46)
  Top 0.33: v23.37,30.73 23.37,32.22 C1.1 | v28.83,26.42 27.18,26.42 v24.77,28.83
  Bottom 0.33: J4.1 29.72,25.53 v28.83,26.42 | v24.77,28.83 24.77,29.34 v23.37,30.73
N$6
  Top 0.33: LED5.C R9.1
N$7
  Top 0.33: X3.C6 4.85,12.42 TP13.TP
N$13
  Top 0.33: 60.05,4.17 U3.2 60.07,4.81 60.07,3.3 59.05,2.29 37.21,2.29 36.2,3.3 TP1.TP
N$15
  Top 0.33: U3.55 55.42,22.14 54.36,21.08 54.36,19.94 54.23,19.81 53.98,19.56 53.72,19.3 TP3.TP
N$20
  Top 0.33: U4.2 50.96,17.24 51.69,16.51 53.47,16.51 54.33,15.64 U3.60
N$21  (via drill 0.25 pad 0.46)
  Top 0.33: U4.3 52.21,17.89 v52.96,17.27 | U3.61 54.11,14.34 v52.96,15.49
  Bottom 0.33: v52.96,15.49 v52.96,17.27
N$23
  Top 0.33: U4.5 50.31,19.19 54.48,23.37 56.8,23.37 U3.54
N$37
  Top 0.33: LED2.C 39.62,19.94 39.62,19.14 R10.1
NETLIGHT
  Top 0.33: U3.6 65.27,7.12 64.39,8 56.64,8 53.09,4.45 51.83,4.45 LED5.A
OE
  Top 0.33: R13.2 43.94,22.48 43.43,21.97 U4.8
PA0  (via drill 0.25 pad 0.46)
  Top 0.33: U2.37 39.95,37.54 v39.5,37.08
  Bottom 0.33: v39.5,37.08 39.5,40.89 41.15,42.55 45.47,42.55 J3.1
PA1  (via drill 0.25 pad 0.46)
  Top 0.33: U2.36 40.75,37.2 v40.13,36.58
  Bottom 0.33: J3.2 47.5,41.78 42.8,41.78 40.13,39.12 v40.13,36.58
PA2  (via drill 0.25 pad 0.46)
  Top 0.33: v41.4,36.96 41.53,37.08 41.53,38.67 U2.35
  Bottom 0.33: J3.3 52.45,43.69 50.42,41.15 43.43,41.15 41.53,39.37 41.53,37.08 v41.4,36.96
PA3
  Top 0.33: U2.34 42.35,40.07 43.81,41.53 52.32,41.53 J3.4
PA4
  Top 0.33: U2.33 45.91,36.89 J6.1
PA5
  Top 0.33: U2.32 47.9,36.09 J6.2
PA6
  Top 0.33: U2.31 49.39,35.29 J6.3
PA7
  Top 0.33: U2.30 51.38,34.49 J6.4
PB0
  Top 0.33: U2.40 37.55,41.49 38.61,42.55 42.55,42.55 J7.1
PB1  (via drill 0.25 pad 0.46)
  Top 0.33: U2.41 36.75,37.39 v36.32,36.96
  Bottom 0.33: v36.32,36.96 36.32,41.15 37.85,42.67 39.88,42.67 J7.2
PB2
  Top 0.33: U2.42 35.95,41.03 J7.3
PB3
  Top 0.33: U2.43 35.15,43.03 J7.4
PRESENCE
  Top 0.33: U3.11 77.47,4.84 77.47,7.37 77.85,7.75 85.22,7.75 87.88,5.08 TP10.TP
PROG
  Top 0.33: R8.2 14.13,29.92 U1.5
RXD0
  Top 0.33: U2.9 31.13,30.49 30.61,29.97 30.61,27.05 29.21,25.65 25.65,25.65 24.64,24.64 J4.3
RXD1
  Top 0.33: U2.11 32.55,24.34 TP15.TP 32.89,20.95 34.04,19.81 35.81,19.81 38.38,17.24 U4.13
SCK  (via drill 0.28 pad 0.46)
  Top 0.33: U2.3 31.38,35.29 v30.61,36.07 | J1.3 19.56,30.61 v20.57,31.62
  Bottom 0.33: v20.57,31.62 20.57,36.07 23.5,38.99 28.83,38.99 30.61,37.21 v30.61,36.07
SETPWRKEY  (via drill 0.25 pad 0.46)
  Top 0.33: U2.13 35.15,25.04 TP12.TP | R11.2 97.13,6.42 Q2.1 92.14,6.42 v91.95,6.6
  Bottom 0.33: v91.95,6.6 63.37,6.6 61.21,8.76 46.99,8.76 36.2,19.56 TP12.TP
SETUC15RESET  (via drill 0.25 pad 0.46)
  Top 0.33: TP11.TP 37.85,24.51 36.58,25.78 36.2,25.78 35.95,26.02 U2.14 | R12.2 93.35,2.38 | 93.35,2.38 Q3.1 | 93.35,2.38 92.88,2.38 92.46,2.79 92.46,5.46 92.84,5.84 v92.96,5.84
  Bottom 0.33: TP11.TP 37.85,18.92 47.12,9.65 61.59,9.65 64.01,7.24 92.46,7.24 92.96,6.73 v92.96,5.84
SHLD
  Top 0.33: J2.P$4 4.65,24.3 5.08,23.88 6.9,23.88 C5.2
  Bottom 0.33: J2.P$3 3.57,30.43 J2.P$2 J2.P$1 3.57,23.41 J2.P$4
SIM_CLK  (via drill 0.25 pad 0.46)
  Top 0.33: R2.1 v41.66,5.71 | U3.14 81.37,2.41 80.36,1.4 v80.26,1.4
  Bottom 0.33: v80.26,1.4 61.09,1.4 58.8,3.68 43.31,3.68 v41.66,5.71
SIM_CLKR
  Top 0.33: C7.1 R2.2 38.82,5.84 38.23,5.84 36.7,7.37 36.7,9.02 35.81,9.91 TP8.TP 35.66,9.88 X3.C3
SIM_DATA
  Top 0.33: X3.C7 7.32,9.91 4.57,9.91 3.14,11.34 R3.2 TP9.TP C9.1
SIM_RST  (via drill 0.25 pad 0.46)
  Top 0.33: U3.15 82.65,2.95 v82.68,2.92 | v41.66,7.49 R6.1
  Bottom 0.33: v41.66,7.49 44.2,4.45 59.05,4.45 61.34,2.16 81.92,2.16 v82.68,2.92
SIM_RSTR
  Top 0.33: X3.C2 35.66,12.42 TP7.TP 38.95,9.56 C6.1 R6.2
SIM_VDD  (via drill 0.25 pad 0.46)
  Top 0.33: X3.C1 35.66,14.96 TP6.TP 37.47,14.99 v38.99,13.84 38.95,13.8 C2.1 | U3.12 78.75,3.19 78.49,2.92 70.74,2.92 v69.6,4.06
  Bottom 0.33: v69.6,4.06 61.85,4.06 59.44,6.48 48.01,6.6 40.89,13.84 v38.99,13.84
SPK1N
  Top 0.33: SP1.NEG 94.36,12.57 93.85,13.08 91.73,13.08 C34.2 | C37.2 89.06,13.04 88.14,13.97 88.14,14.86 87.38,15.62 85.9,15.62 U3.21
  pour Top: 89.79,13.34 91.95,13.34 91.95,11.18 89.79,11.18
SPK1P
  Top 0.33: SP1.POS 94.36,15.11 93.85,14.61 91.73,14.61 C34.1 | U3.22 87.83,16.94 88.52,16.26 90.13,16.26 C36.2
  pour Top: 89.79,16.51 89.79,14.35 91.95,14.35 91.95,16.51
TXD0
  Top 0.33: U2.10 31.47,29.69 31.24,29.46 31.24,26.67 29.46,24.89 27.94,24.89 27.18,24.13 J4.2
TXD1
  Top 0.33: U2.12 34.35,22.54 TP14.TP 39,17.89 U4.12
UC15STATUS
  Top 0.33: U4.10 42.78,19.19 42.55,19.43 42.55,20.95 41.27,22.23 40.4,22.23 LED2.A 38.61,23.99 38.61,24.77 37.55,25.82 U2.16
VBAT  (via drill 0.25 pad 0.46)
  Top 0.33: C4.1 R4.2 C11.1 | U2.27 46.53,32.09 C18.1 47.33,32.17 v47.75,32 | U2.38 39.15,41.07 C15.1 39.41,40.89 v39.37,41.91 | U2.17 38.35,26.04 39.24,25.15 39.84,25.15 | 39.84,25.15 C17.1 | U2.5 31.08,33.69 30.86,33.91 30.86,34.71 C12.1 29.46,36.11 v29.46,37.21 | 39.84,25.15 39.84,25.87 v39.88,25.91 | C41.1 43.52,16.51 U4.14 43.56,16.47 v43.56,15.75 | LED3.A 12.31,36.33 v12.32,36.32 | U1.3 12.26,33.59 v12.32,33.66
  Top 0.508: J5.1 12.12,39.39 C13.1 12.31,39.57 LED3.A
  other vias: 50.55,27.69 50.55,26.8 51.56,27.69 52.7,27.69 51.56,26.8 52.7,26.8 53.72,27.69 53.72,26.8 54.74,26.8 54.74,27.69
  pour Top: 54.86,30.23 48.51,30.23 48.51,24.38 57.91,24.38 57.91,28.57 54.86,28.57
  pour PWR: 0,46.23 58.29,46.23 58.29,22.48 50.16,21.84 44.2,14.73 42.67,14.73 36.45,22.61 0.25,22.35 0,22.1
VDD_EXT  (via drill 0.25 pad 0.46)
  Top 0.33: R13.1 46.61,22.48 48.01,21.08 48.01,17.14 48.56,16.59 U4.1 49.27,9.02 v49.28,3.05 | U3.7 67.78,4.49 C39.1 66.89,0.89 49.91,0.89 v49.28,1.52
  Bottom 0.33: v49.28,3.05 v49.28,1.52
XTAL1
  Top 0.33: X2.P$2 27.82,30.9 C14.1 29.86,31.29 U2.8
XTAL2
  Top 0.33: X2.P$1 27.82,32.47 C10.1 29.84,32.09 U2.7

### Text on the board
bNames: 3G Module Prototype Board v1 / Wickerbox Electronics / http://wickerbox.net/